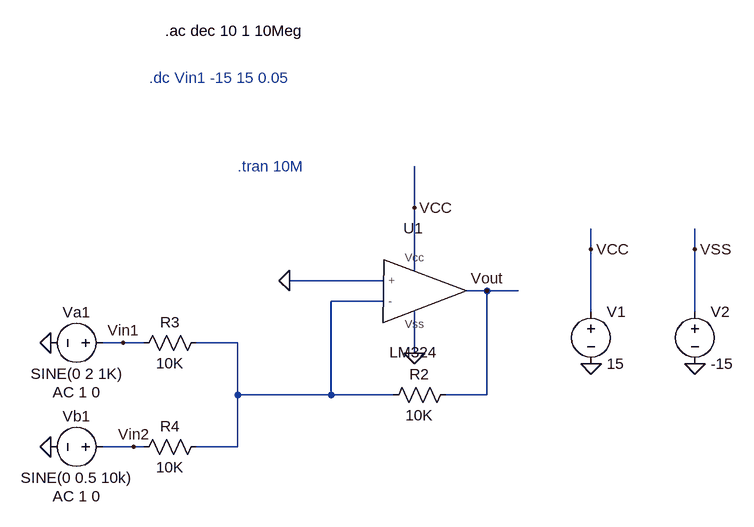
[diagram p0: schematic BAI 3 THUC HANH 2.asc]
BAI 3 THUC HANH 2.asc, the LTspice schematic file:
Version 4.1
SHEET 1 880 748
WIRE 208 272 208 208
WIRE 480 336 480 304
WIRE 640 336 640 304
WIRE 208 368 208 272
WIRE 160 384 16 384
WIRE 320 400 288 400
WIRE 368 400 320 400
WIRE 160 416 80 416
WIRE 480 432 480 336
WIRE 640 432 640 336
WIRE -240 480 -272 480
WIRE -208 480 -240 480
WIRE -64 480 -128 480
WIRE 208 496 208 432
WIRE -64 560 -64 480
WIRE 80 560 80 416
WIRE 80 560 -64 560
WIRE 176 560 80 560
WIRE 320 560 320 400
WIRE 320 560 256 560
WIRE -224 640 -272 640
WIRE -208 640 -224 640
WIRE -64 640 -64 560
WIRE -64 640 -128 640
FLAG 320 400 Vout
FLAG -352 480 0
FLAG -352 640 0
FLAG 208 272 VCC
FLAG 480 512 0
FLAG 480 336 VCC
FLAG 208 496 0
FLAG -240 480 Vin1
FLAG -224 640 Vin2
FLAG 16 384 0
FLAG 640 512 0
FLAG 640 336 VSS
SYMBOL LM324 208 400 R0
SYMATTR InstName U1
SYMBOL res 272 544 R90
WINDOW 0 0 56 VBottom 2
WINDOW 3 32 56 VTop 2
SYMATTR InstName R2
SYMATTR Value 10K
SYMBOL res -112 464 R90
WINDOW 0 0 56 VBottom 2
WINDOW 3 32 56 VTop 2
SYMATTR InstName R3
SYMATTR Value 10K
SYMBOL voltage -256 480 R90
WINDOW 0 -32 56 VBottom 2
WINDOW 3 32 56 VTop 2
WINDOW 39 0 0 Left 0
WINDOW 123 60 56 VTop 2
SYMATTR InstName Va1
SYMATTR Value SINE(0 2 1K)
SYMATTR Value2 AC 1 0
SYMBOL res -112 624 R90
WINDOW 0 0 56 VBottom 2
WINDOW 3 32 56 VTop 2
SYMATTR InstName R4
SYMATTR Value 10K
SYMATTR SpiceLine pwr=0.
SYMBOL voltage -256 640 R90
WINDOW 0 -32 56 VBottom 2
WINDOW 3 32 56 VTop 2
WINDOW 123 60 56 VTop 2
WINDOW 39 0 0 Left 0
SYMATTR InstName Vb1
SYMATTR Value SINE(0 0.5 10k)
SYMATTR Value2 AC 1 0
SYMBOL voltage 480 416 R0
WINDOW 123 0 0 Left 0
WINDOW 39 0 0 Left 0
SYMATTR InstName V1
SYMATTR Value 15
SYMBOL voltage 640 416 R0
WINDOW 123 0 0 Left 0
WINDOW 39 0 0 Left 0
SYMATTR InstName V2
SYMATTR Value -15
TEXT -64 208 Left 2 ;.tran 10M
TEXT -176 0 Left 2 !.ac dec 10 1 10Meg
TEXT -200 72 Left 2 ;.dc Vin1 -15 15 0.05

The netlist it stands for:
* BAI 3 THUC HANH 2.asc
X§U1 0 N001 VCC 0 Vout LM324  ; pins + - Vcc Vss ?
R2 Vout N001 10K
R3 N001 Vin1 10K
Va1 Vin1 0 SINE(0 2 1K) AC 1 0
R4 N001 Vin2 10K pwr=0.
Vb1 Vin2 0 SINE(0 0.5 10k) AC 1 0
V1 VCC 0 15
V2 VSS 0 -15
* .tran 10M
.ac dec 10 1 10Meg
* .dc Vin1 -15 15 0.05
.lib E:\ThiThucHanhCoHa\CoHa\LM324.cir
.backanno
.end